# EAGLE design LM555 (EAGLE 7.2.0)
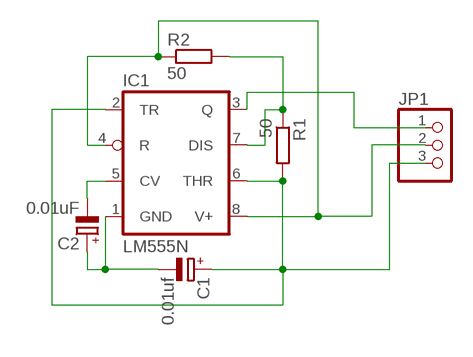
[diagram p0: schematic, sheet 1]

## Parts
C1  0.01uf  CPOL-EUE2.5-6  [E2,5-6]
C2  0.01uF  CPOL-EUE2.5-6  [E2,5-6]
IC1  LM555N  [DIL08]
JP1  PINHD-1X3  [1X03]
R1  50  R-EU_0207/10  [0207/10]
R2  50  R-EU_0207/10  [0207/10]

## Nets
N$1: IC1.7(DIS) R1.1 R2.2
N$2: C1.- C2.+ IC1.1(GND)
N$3: C2.- IC1.5(CV)
N$4: C1.+ IC1.2(TR) IC1.6(THR) JP1.3 R1.2
N$7: IC1.4(R) IC1.8(V+) JP1.2 R2.1
N$8: IC1.3(Q) JP1.1

## Library data of the parts
C1 C2 = rcl:CPOL-EU: POLARIZED CAPACITOR, European symbol
IC1 = linear:*555: TIMER
JP1 = pinhead:PINHD-1X3: PIN HEADER
R1 R2 = rcl:R-EU_: RESISTOR, European symbol

## Board
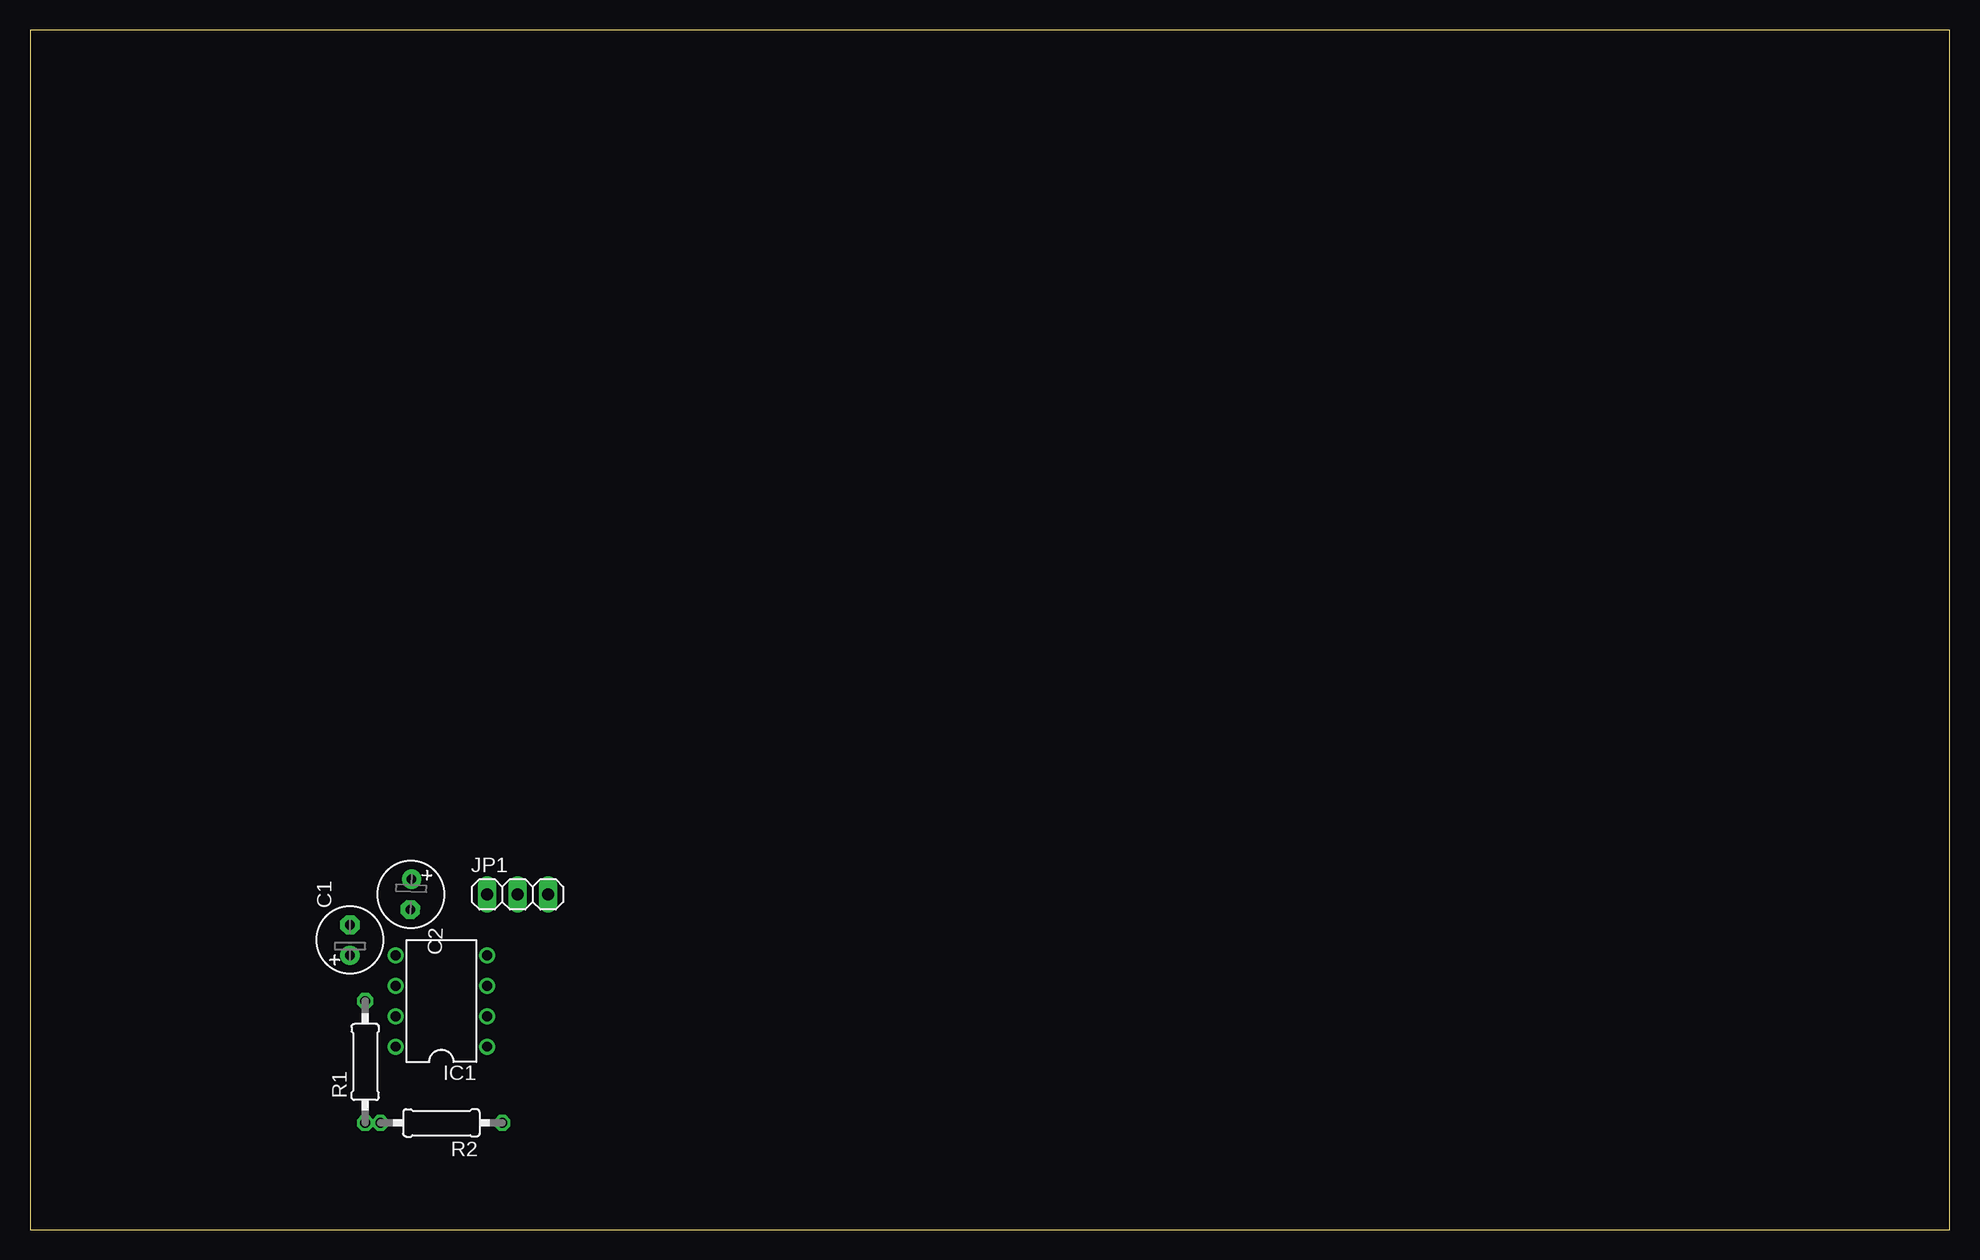
[diagram p1: board, top side]
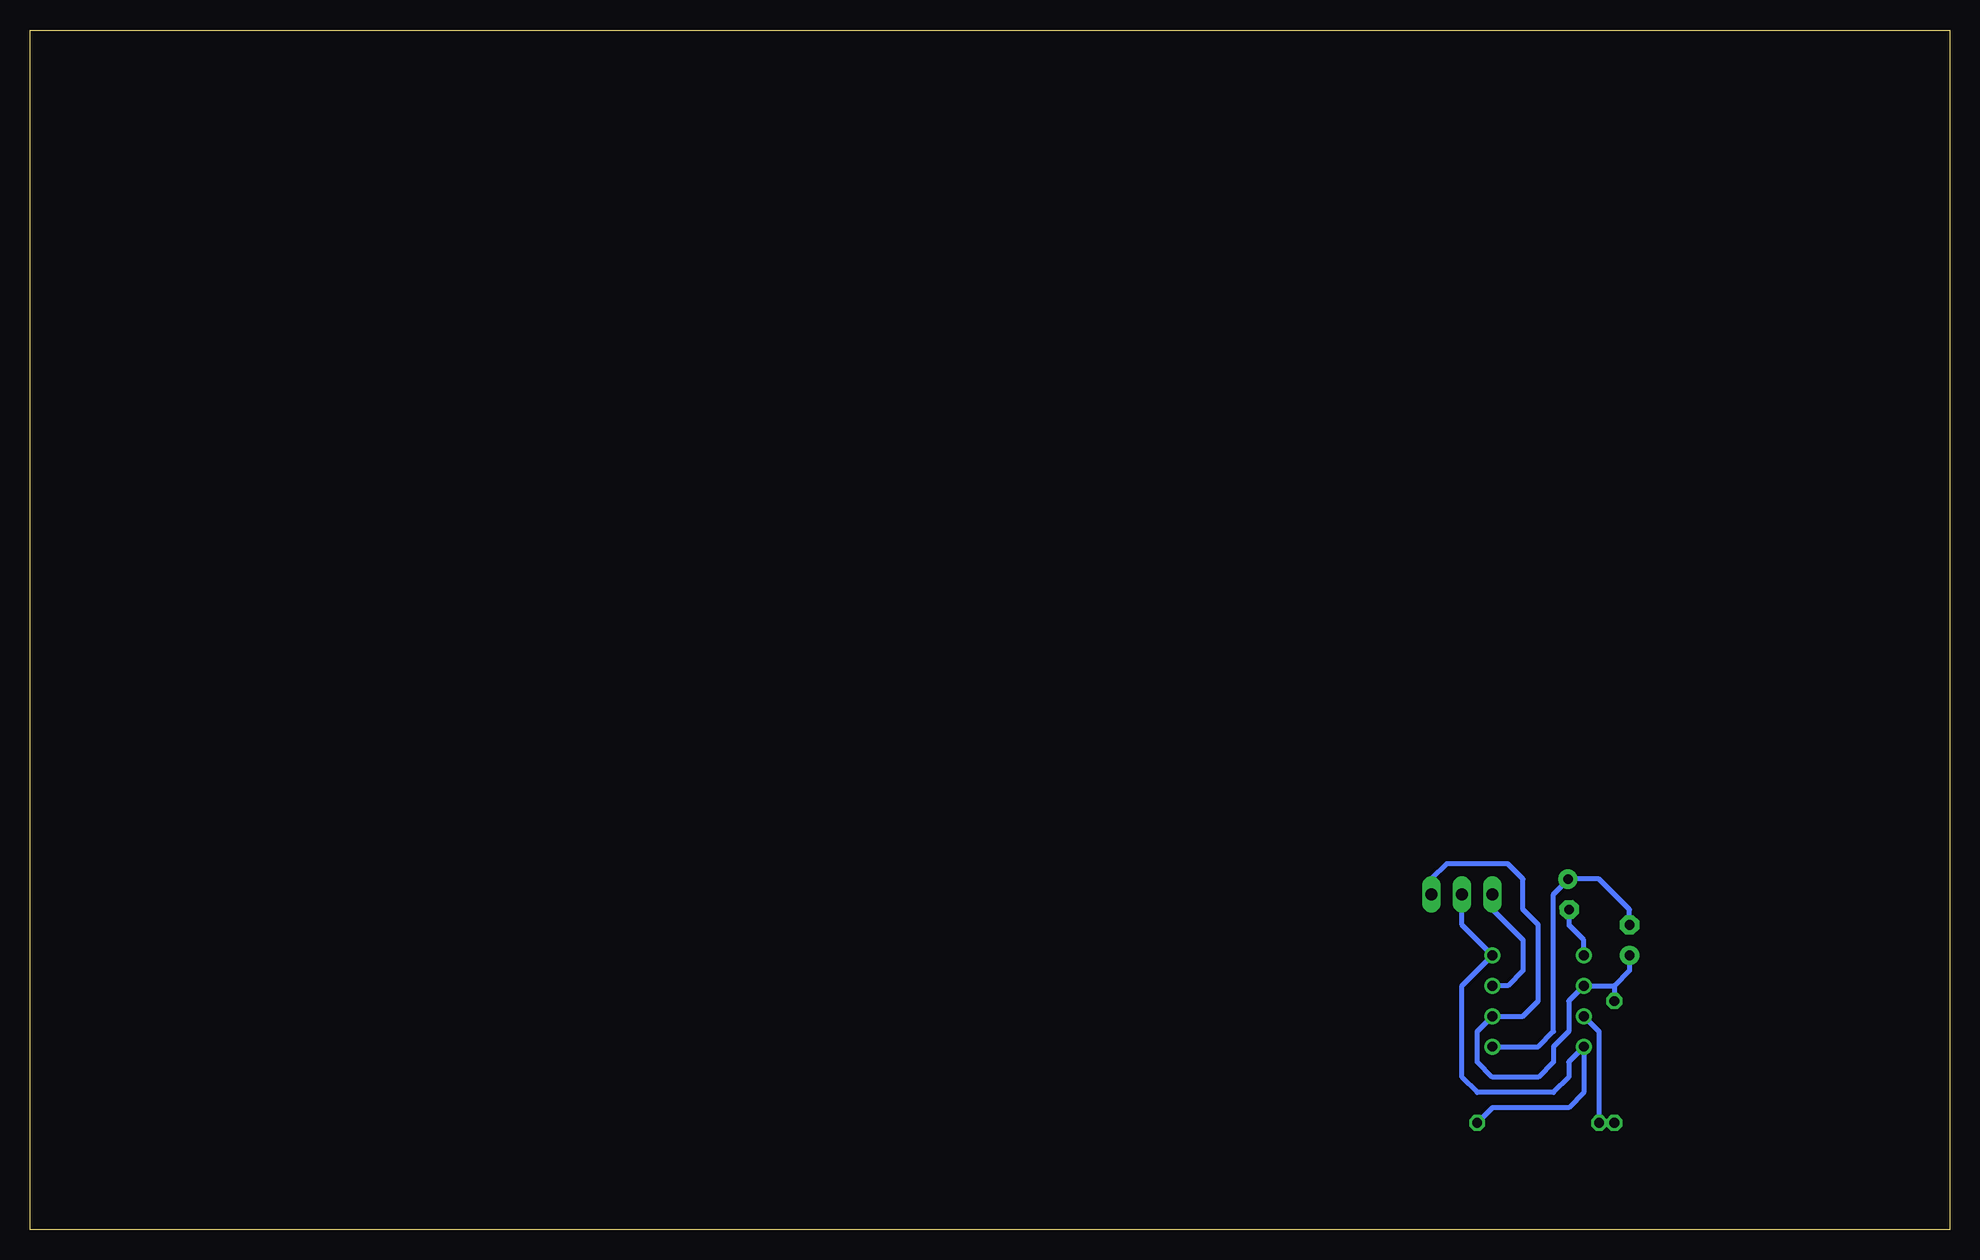
[diagram p2: board, bottom side, seen from below]

Size 160 x 100 mm. Coordinates in mm from the lower left corner, seen from the top.
Outline: 0,0 160,0 160,100 0,100 0,0
Copper layers (1*16): Top 0.035mm / dielectric 1.5mm / Bottom 0.035mm
Design rules "default": minimum track width 10mil, minimum drill 24mil, track to track 8mil, track to pad 8mil, pad to pad 8mil, via to via 8mil, smd to smd 8mil, copper to edge 40mil, drill to drill 8mil, minimum pad ring 10mil, minimum via ring 8mil, stop-mask expansion 4mil, vias tented up to drill 0mil, thermal gap 10mil

### Footprints (pad centres in the part's own frame; a part is rotated, then mirrored left to right if it is on the bottom)
E2,5-6 = drill 0.813 pad 1.6: + -1.27,0 | drill 0.813 pad 1.6 octagon: - 1.27,0
DIL08 = drill 0.813 pad 1.27: 1 -3.81,-3.81; 2 -1.27,-3.81; 3 1.27,-3.81; 4 3.81,-3.81; 5 3.81,3.81; 6 1.27,3.81; 7 -1.27,3.81; 8 -3.81,3.81
1X03 = drill 1.016 long: 1 -2.54,0; 2 0,0; 3 2.54,0
0207/10 = drill 0.813 octagon: 1 -5.08,0; 2 5.08,0

### Placement (x,y rotation side)
C1  26.67,24.13 90 top
C2  31.75,27.94 267.7 top
IC1  34.29,19.05 90 top
JP1  40.64,27.94 0 top
R1  27.94,13.97 90 top
R2  34.29,8.89 180 top

### Tracks (layer width: path | path; a pad name or v marks a point on that pad's centre or on a via)
N$1
  Bottom 0.406: R1.1 R2.2 29.21,16.51 IC1.7
N$2
  Bottom 0.406: C1.- 26.67,26.67 29.21,29.21 C2.+ 31.8,29.16 33.02,27.94 33.02,16.51 34.29,15.24 IC1.1
N$3
  Bottom 0.406: IC1.5 30.48,24.13 31.7,25.35 C2.-
N$4
  Bottom 0.406: C1.+ 26.67,21.59 27.94,20.32 | 27.94,20.32 R1.2 | 27.94,20.32 IC1.6 31.75,19.05 31.75,16.51 33.02,15.24 33.02,13.97 34.29,12.7 38.1,12.7 39.37,13.97 39.37,16.51 IC1.2 35.56,17.78 34.29,19.05 34.29,25.4 35.56,26.67 35.56,29.21 36.83,30.48 41.91,30.48 43.18,29.21 JP1.3
N$7
  Bottom 0.406: R2.1 38.1,10.16 31.75,10.16 30.48,11.43 IC1.8 31.75,13.97 31.75,12.7 33.02,11.43 39.37,11.43 40.64,12.7 40.64,20.32 IC1.4 40.64,25.4 JP1.2
N$8
  Bottom 0.406: JP1.1 38.1,26.67 35.56,24.13 35.56,21.59 36.83,20.32 IC1.3